# Altium schematic sheet motordriver-v5.1_demux.SchDoc
size A4; SheetNumber: 11; SheetTotal: 12
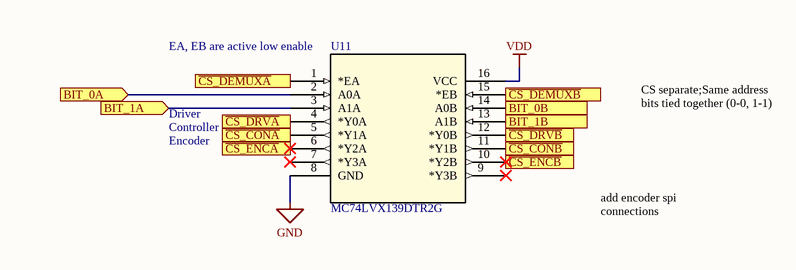
[diagram p0: motordriver-v5.1_demux.SchDoc]

## Parts
U11  MC74LVX139DTR2G  [TSSOP-16_ONS]

## Ports
BIT_0A (in), BIT_0B (in), BIT_1A (in), BIT_1B (in), ~{CS_CONA} (out), ~{CS_CONB} (out), ~{CS_DEMUXA} (in), ~{CS_DEMUXB} (in), ~{CS_DRVA} (out), ~{CS_DRVB} (out), ~{CS_ENCA} (out), ~{CS_ENCB} (out)

## Nets
GND: U11.8(GND)
VDD: U11.16(VCC)
BIT_0A: U11.2(A0A) ; port BIT_0A
BIT_0B: U11.14(A0B) ; port BIT_0B
BIT_1A: U11.3(A1A) ; port BIT_1A
BIT_1B: U11.13(A1B) ; port BIT_1B
~{CS_CONA}: U11.5(*Y1A) ; port ~{CS_CONA}
~{CS_CONB}: U11.11(*Y1B) ; port ~{CS_CONB}
~{CS_DEMUXA}: U11.1(*EA) ; port ~{CS_DEMUXA}
~{CS_DEMUXB}: U11.15(*EB) ; port ~{CS_DEMUXB}
~{CS_DRVA}: U11.4(*Y0A) ; port ~{CS_DRVA}
~{CS_DRVB}: U11.12(*Y0B) ; port ~{CS_DRVB}
~{CS_ENCA}: U11.6(*Y2A) ; port ~{CS_ENCA}
~{CS_ENCB}: U11.10(*Y2B) ; port ~{CS_ENCB}

Not connected (* = marked no-connect by the designer): U11 7(*Y3A)* 9(*Y3B)*

## Notes on the sheet
- (near U11) EA, EB are active low enable
- Controller
- Driver
- Encoder
- CS separate;Same address bits tied together (0-0, 1-1)
- add encoder spi connections

## Library data of the parts
U11 = MC74LVX139DTR2G: 2-3.6V Dual 2-to-8 Decoder; Mfr_Name: onsemi; Manufacturer Part Number: MC74LVX139DTR2G / MC74LVX139DTR2GMC74LVX139DTR2G / MC74LVX139DTR2GMC74LVX139DTR2G / MC74LVX139DTR2G; Manufacturer_Part_Number: MC74LVX139DTR2G; Digi-Key_Part_Number_1: MC74LVX139DTR2G-ND; Digi-Key_Part_Number_2: 2156-MC74LVX139DTR2G-OS-ND; Type: DEV; Supplier: Mouser; Link: https://www.mouser.ca/ProductDetail/onsemi/MC74LVX139DTR2G?qs=YOLdObVcOZlxCYeV3EwYHQ%3D%3D*; Part Number: MC74LVX139DTR2G; Supplier 1: Mouser; Supplier Part Number 1: 863-MC74LVX139DTR2G; Suppler URL 1: https://www.mouser.ca/ProductDetail/onsemi/MC74LVX139DTR2G?qs=YOLdObVcOZlxCYeV3EwYHQ%3D%3D